# Altium project FMC_Version2.PrjPcb
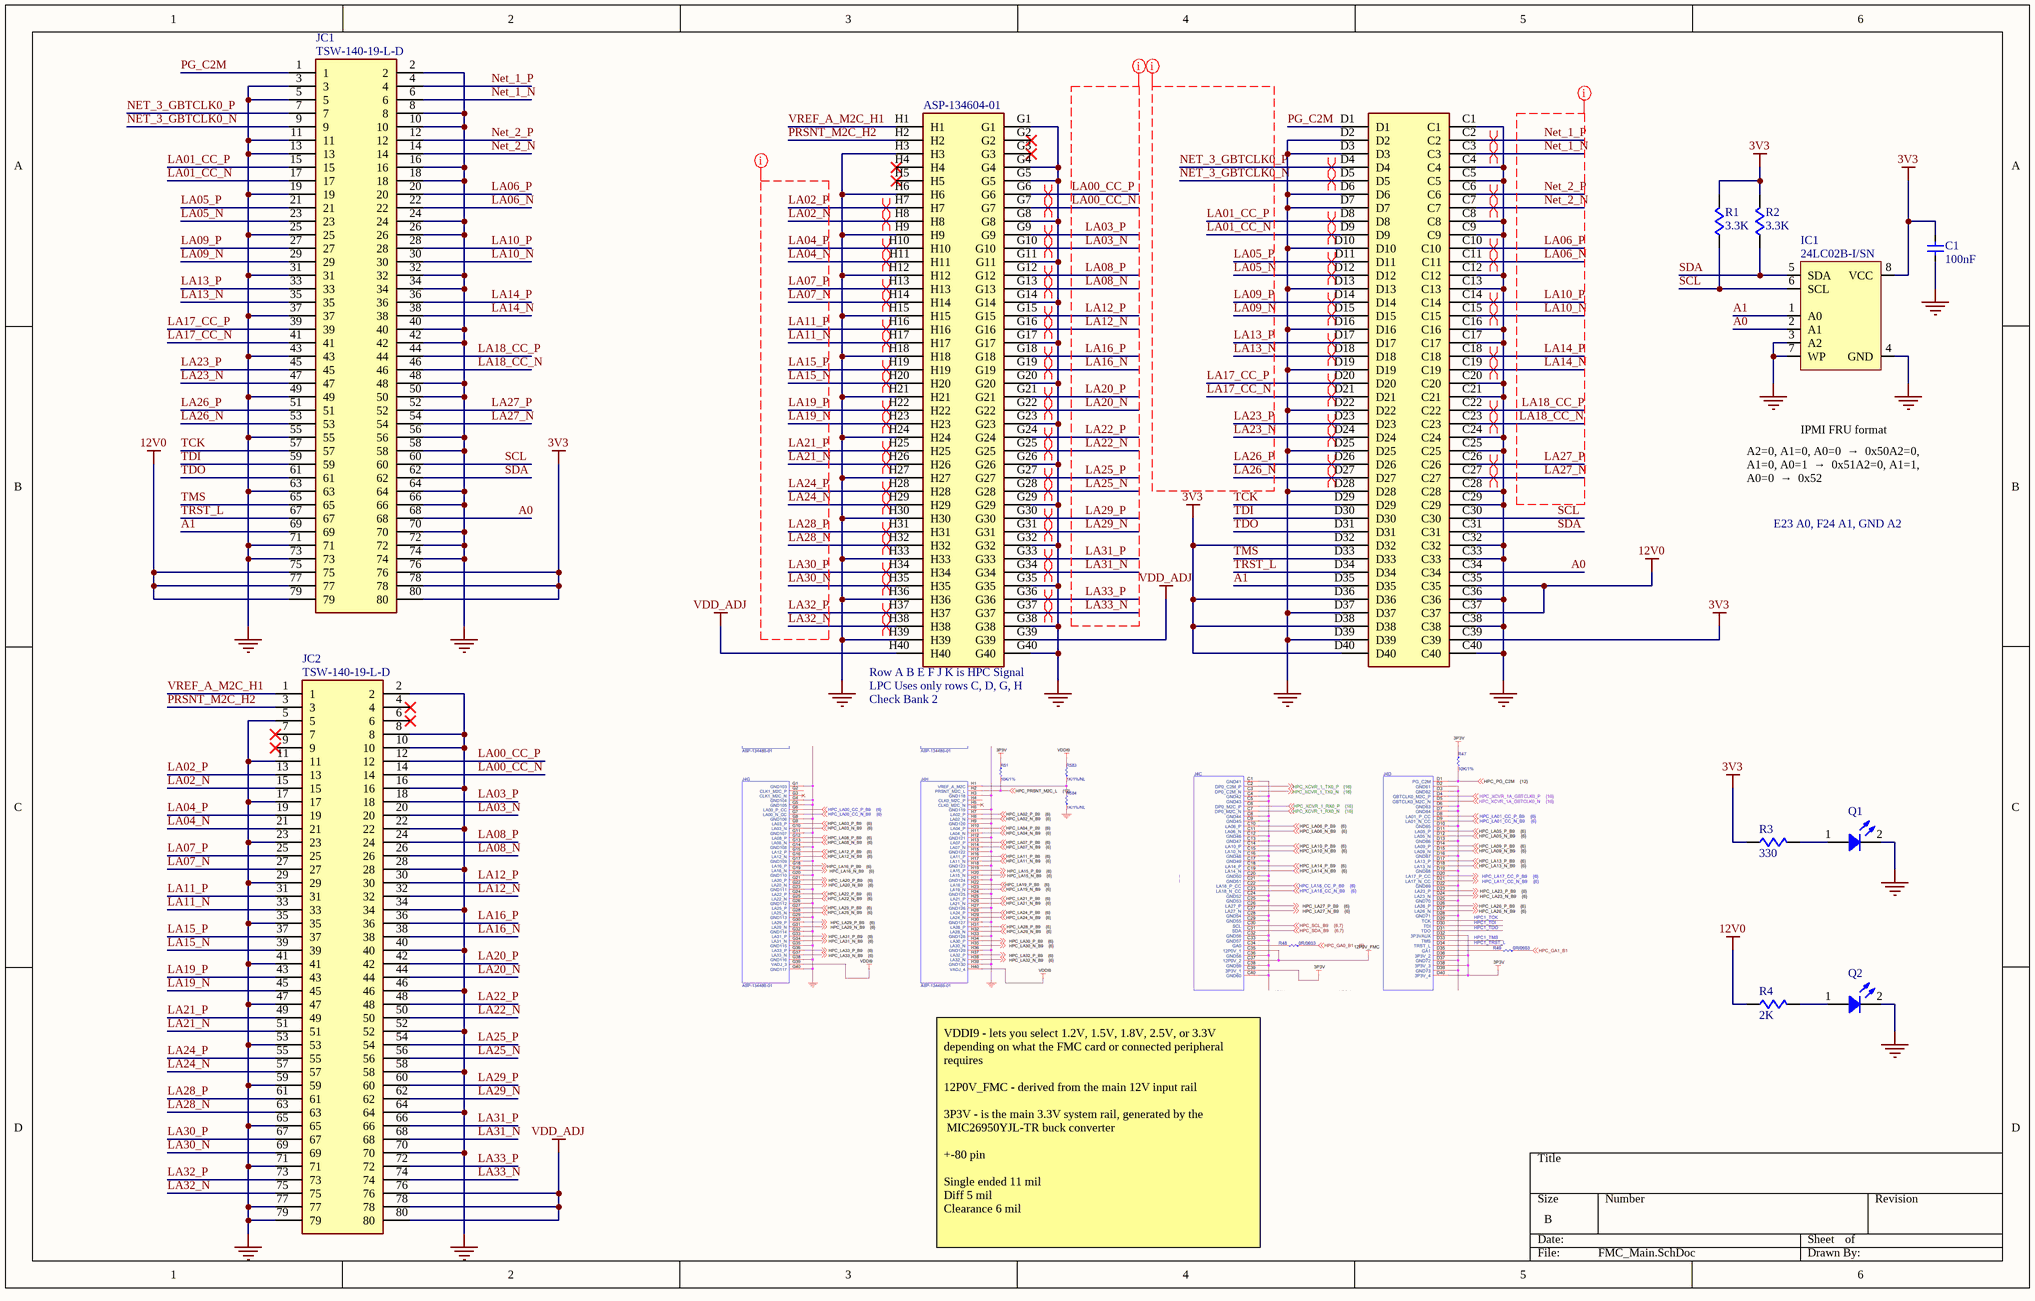
[diagram p0: FMC_Main.SchDoc]
1 sheet, 11 parts. Net scope: global (net labels, ports and power ports of the same name join across sheets).
Board file: FMC_Main.PcbDoc

## Sheet FMC_Main.SchDoc
size B; SheetNumber: 1; SheetTotal: 1

### Parts
C1  value 100nF  [CAP0402_N]  (hidden comment: CAPCER)
IC1  Manufacturer P/N 1: 24LC02B-I/SN  [SOIC_8]  (hidden comment: 24LC02B-ISN)
JC1  TSW-140-19-L-D  [TSW-140-19-L-D]
JC2  TSW-140-19-L-D  [TSW-140-19-L-D]
JC3  ASP-134604-01  [ASP-134604-01]
Q1  LED  [0603LED]  (value not drawn)
Q2  LED  [0603LED]  (value not drawn)
R1  value 3.3K  [RES0402_N]  (hidden comment: RES)
R2  value 3.3K  [RES0402_N]  (hidden comment: RES)
R3  value 330  [RES0402_N]  (hidden comment: RES)
R4  value 2K  [RES0402_N]  (hidden comment: RES)

### Nets
3V3: C1.2 IC1.8(VCC) JC1.76 JC1.78 JC1.80 JC3.C39 JC3.D32 JC3.D36 JC3.D38 JC3.D40 R1.2 R2.2 R3.1
12V0: JC1.75 JC1.77 JC1.79 JC3.C35 JC3.C37 R4.1
GND: C1.1 IC1.3(A2) IC1.4(GND) IC1.7(WP) JC1.2 JC1.3 JC1.5 JC1.8 JC1.10 JC1.11 JC1.13 JC1.16 JC1.18 JC1.19 JC1.24 JC1.25 JC1.26 JC1.31 JC1.32 JC1.34 JC1.37 JC1.40 JC1.42 JC1.43 JC1.48 JC1.49 JC1.50 JC1.55 JC1.56 JC1.58 JC1.63 JC1.64 JC1.66 JC1.70 JC1.71 JC1.72 JC1.73 JC1.74 JC2.2 JC2.5 JC2.8 JC2.10 JC2.11 JC2.16 JC2.17 JC2.22 JC2.23 JC2.28 JC2.29 JC2.34 JC2.35 JC2.40 JC2.41 JC2.46 JC2.47 JC2.52 JC2.53 JC2.58 JC2.59 JC2.64 JC2.65 JC2.70 JC2.71 JC2.77 JC2.79 JC3.C1 JC3.C4 JC3.C5 JC3.C8 JC3.C9 JC3.C12 JC3.C13 JC3.C16 JC3.C17 JC3.C20 JC3.C21 JC3.C24 JC3.C25 JC3.C28 JC3.C29 JC3.C32 JC3.C33 JC3.C36 JC3.C38 JC3.C40 JC3.D2 JC3.D3 JC3.D6 JC3.D7 JC3.D10 JC3.D13 JC3.D16 JC3.D19 JC3.D22 JC3.D25 JC3.D28 JC3.D37 JC3.D39 JC3.G1 JC3.G4 JC3.G5 JC3.G8 JC3.G11 JC3.G14 JC3.G17 JC3.G20 JC3.G23 JC3.G26 JC3.G29 JC3.G32 JC3.G35 JC3.G38 JC3.G40 JC3.H3 JC3.H6 JC3.H9 JC3.H12 JC3.H15 JC3.H18 JC3.H21 JC3.H24 JC3.H27 JC3.H30 JC3.H33 JC3.H36 JC3.H39 Q1.2 Q2.2
VDD_ADJ: JC2.76 JC2.78 JC2.80 JC3.G39 JC3.H40
A0: IC1.2(A1) JC1.68 JC3.C34
A1: IC1.1(A0) JC1.69 JC3.D35
LA00_CC_N: JC2.14 JC3.G7
LA00_CC_P: JC2.12 JC3.G6
LA01_CC_N: JC1.17 JC3.D9
LA01_CC_P: JC1.15 JC3.D8
LA02_N: JC2.15 JC3.H8
LA02_P: JC2.13 JC3.H7
LA03_N: JC2.20 JC3.G10
LA03_P: JC2.18 JC3.G9
LA04_N: JC2.21 JC3.H11
LA04_P: JC2.19 JC3.H10
LA05_N: JC1.23 JC3.D12
LA05_P: JC1.21 JC3.D11
LA06_N: JC1.22 JC3.C11
LA06_P: JC1.20 JC3.C10
LA07_N: JC2.27 JC3.H14
LA07_P: JC2.25 JC3.H13
LA08_N: JC2.26 JC3.G13
LA08_P: JC2.24 JC3.G12
LA09_N: JC1.29 JC3.D15
LA09_P: JC1.27 JC3.D14
LA10_N: JC1.30 JC3.C15
LA10_P: JC1.28 JC3.C14
LA11_N: JC2.33 JC3.H17
LA11_P: JC2.31 JC3.H16
LA12_N: JC2.32 JC3.G16
LA12_P: JC2.30 JC3.G15
LA13_N: JC1.35 JC3.D18
LA13_P: JC1.33 JC3.D17
LA14_N: JC1.38 JC3.C19
LA14_P: JC1.36 JC3.C18
LA15_N: JC2.39 JC3.H20
LA15_P: JC2.37 JC3.H19
LA16_N: JC2.38 JC3.G19
LA16_P: JC2.36 JC3.G18
LA17_CC_N: JC1.41 JC3.D21
LA17_CC_P: JC1.39 JC3.D20
LA18_CC_N: JC1.46 JC3.C23
LA18_CC_P: JC1.44 JC3.C22
LA19_N: JC2.45 JC3.H23
LA19_P: JC2.43 JC3.H22
LA20_N: JC2.44 JC3.G22
LA20_P: JC2.42 JC3.G21
LA21_N: JC2.51 JC3.H26
LA21_P: JC2.49 JC3.H25
LA22_N: JC2.50 JC3.G25
LA22_P: JC2.48 JC3.G24
LA23_N: JC1.47 JC3.D24
LA23_P: JC1.45 JC3.D23
LA24_N: JC2.57 JC3.H29
LA24_P: JC2.55 JC3.H28
LA25_N: JC2.56 JC3.G28
LA25_P: JC2.54 JC3.G27
LA26_N: JC1.53 JC3.D27
LA26_P: JC1.51 JC3.D26
LA27_N: JC1.54 JC3.C27
LA27_P: JC1.52 JC3.C26
LA28_N: JC2.63 JC3.H32
LA28_P: JC2.61 JC3.H31
LA29_N: JC2.62 JC3.G31
LA29_P: JC2.60 JC3.G30
LA30_N: JC2.69 JC3.H35
LA30_P: JC2.67 JC3.H34
LA31_N: JC2.68 JC3.G34
LA31_P: JC2.66 JC3.G33
LA32_N: JC2.75 JC3.H38
LA32_P: JC2.73 JC3.H37
LA33_N: JC2.74 JC3.G37
LA33_P: JC2.72 JC3.G36
Net_1_N: JC1.6 JC3.C3
Net_1_P: JC1.4 JC3.C2
Net_2_N: JC1.14 JC3.C7
Net_2_P: JC1.12 JC3.C6
NET_3_GBTCLK0_N: JC1.9 JC3.D5
NET_3_GBTCLK0_P: JC1.7 JC3.D4
PG_C2M: JC1.1 JC3.D1
PRSNT_M2C_H2: JC2.3 JC3.H2
SCL: IC1.6(SCL) JC1.60 JC3.C30 R1.1
SDA: IC1.5(SDA) JC1.62 JC3.C31 R2.1
TCK: JC1.57 JC3.D29
TDI: JC1.59 JC3.D30
TDO: JC1.61 JC3.D31
TMS: JC1.65 JC3.D33
TRST_L: JC1.67 JC3.D34
VREF_A_M2C_H1: JC2.1 JC3.H1
NetQ1_1: Q1.1 R3.2
NetQ2_1: Q2.1 R4.2

Not connected (* = marked no-connect by the designer): JC2 4* 6* 7* 9*; JC3 G2* G3* H4* H5*

### Layout directives
differential pair: LA00_CC_N, LA00_CC_P, LA01_CC_N, LA01_CC_P, LA02_N, LA02_P, LA03_N, LA03_P, LA04_N, LA04_P, LA05_N, LA05_P, LA06_N, LA06_P, LA07_N, LA07_P, LA08_N, LA08_P, LA09_N, LA09_P, LA10_N, LA10_P, LA11_N, LA11_P, LA12_N, LA12_P, LA13_N, LA13_P, LA14_N, LA14_P, LA15_N, LA15_P, LA16_N, LA16_P, LA17_CC_N, LA17_CC_P, LA18_CC_N, LA18_CC_P, LA19_N, LA19_P, LA20_N, LA20_P, LA21_N, LA21_P, LA22_N, LA22_P, LA23_N, LA23_P, LA24_N, LA24_P, LA25_N, LA25_P, LA26_N, LA26_P, LA27_N, LA27_P, LA28_N, LA28_P, LA29_N, LA29_P, LA30_N, LA30_P, LA31_N, LA31_P, LA32_N, LA32_P, LA33_N, LA33_P, Net_1_N, Net_1_P, Net_2_N, Net_2_P, NET_3_GBTCLK0_N, NET_3_GBTCLK0_P
rule Width Constraint [Pref Width = 4.5mil    Min Width = 4.5mil    Max Width = 4.5mil]; net class DIFF_PAIR: LA00_CC_N, LA00_CC_P, LA01_CC_N, LA01_CC_P, LA02_N, LA02_P, LA03_N, LA03_P, LA04_N, LA04_P, LA05_N, LA05_P, LA06_N, LA06_P, LA07_N, LA07_P, LA08_N, LA08_P, LA09_N, LA09_P, LA10_N, LA10_P, LA11_N, LA11_P, LA12_N, LA12_P, LA13_N, LA13_P, LA14_N, LA14_P, LA15_N, LA15_P, LA16_N, LA16_P, LA17_CC_N, LA17_CC_P, LA18_CC_N, LA18_CC_P, LA19_N, LA19_P, LA20_N, LA20_P, LA21_N, LA21_P, LA22_N, LA22_P, LA23_N, LA23_P, LA24_N, LA24_P, LA25_N, LA25_P, LA26_N, LA26_P, LA27_N, LA27_P, LA28_N, LA28_P, LA29_N, LA29_P, LA30_N, LA30_P, LA31_N, LA31_P, LA32_N, LA32_P, LA33_N, LA33_P, Net_1_N, Net_1_P, Net_2_N, Net_2_P, NET_3_GBTCLK0_N, NET_3_GBTCLK0_P

### Notes on the sheet
- IPMI FRU format
- A2=0, A1=0, A0=0  →  0x50A2=0, A1=0, A0=1  →  0x51A2=0, A1=1, A0=0  →  0x52
- E23 A0, F24 A1, GND A2
- (near JC3) Row A B E F J K is HPC Signal
- (near JC3) LPC Uses only rows C, D, G, H
- (near JC3) Check Bank 2
- VDDI9 - lets you select 1.2V, 1.5V, 1.8V, 2.5V, or 3.3V depending on what the FMC card or connected peripheral requires
  12P0V_FMC - derived from the main 12V input rail
  3P3V - is the main 3.3V system rail, generated by the
  MIC26950YJL-TR buck converter
  +-80 pin
  Single ended 11 mil
  Diff 5 mil
  Clearance 6 mil

### Library data of the parts
C1 = CC-000021: CAP CER 100nF 16V ±5% X7R 0402; Manufacturer Name 1: Yageo; Manufacturer P/N 1: CC0402JRX7R7BB104; Company P/N: CC-000021; Footprint: 0402; Tolerance: ±5%; Price @ 1k: 0.004; Manufacturer Name 2: AVX; Manufacturer P/N 2: 0402YC104JAT2A; Operating Temperature: -55°C ~ 125°C; Status: ACTIVE; Temperature Coefficient: X7R; Voltage: 16V
IC1 = IC-000083: IC EEPROM 2KBIT I2C 400KHZ 8MSOP; Manufacturer Name 1: Microchip Technology; Operating Voltage: 2.5V ~ 5.5V; Company P/N: IC-000083; Footprint: 8-MSOP; Features: EEPROM Memory IC 2Kbit I2C 400 kHz 900; Pin Count: 8; Price @ 1k: 0.35; Operating Temperature: -40°C ~ 85°C (TA)
JC1 JC2 = JC-000050: CONN HEADER TH 80POS 2.54MM; Manufacturer Name 1: MOLEX; Company P/N: JC-000050; Manufacturer P/N 1: TSW-140-19-L-D; Footprint: TH; Pin Count: 80; Price @ 1k: 4
JC3 = JC-000046: CONN ARRAY PLUG 160POS SMD GOLD; Manufacturer Name 1: Samtec Inc.; Company P/N: JC-000046; Manufacturer P/N 1: ASP-134604-01; Footprint: SMD; Pin Count: 160; Price @ 1k: 14
Q1 Q2 = QC-000018: LED YELLOW SMD 0603; Manufacturer P/N 1: LTST-C190KSKT; Manufacturer Name 1: Lite-On Inc.; Current: 20mA; Voltage: 3V; Company P/N: QC-000018; Footprint: 0603; Pin Count: 2; Price @ 1k: 0.046; Operating Temperature: -30°C ~ 85°C
R1 R2 = RC-000035: RES SMD 3.3K 1% 1/16W 0402; Manufacturer Name 1: Stackpole Electronics Inc; Manufacturer P/N 1: RMCF0402FT3K30; Company P/N: RC-000035; Footprint: 0402; Power: 1/16W; Tolerance: 1%; Price @ 1k: 0.002; Manufacturer Name 2: Yageo; Manufacturer P/N 2: AF0402FR-073K3L; Operating Temperature: -55°C ~ 155°C; Status: ACTIVE
R3 = RC-000069: RES 330 OHM 1% 1/10W 0402; Manufacturer Name 1: KOA Speer Electronics, Inc.; Manufacturer P/N 1: RK73H1ETTP3300F; Company P/N: RC-000069; Footprint: 0402; Power: 1/10W; Tolerance: 1%; Price @ 1k: 0.01; Operating Temperature: -55°C ~ 155°C
R4 = RC-000029: RES SMD 2K 1% 1/16W 0402; Manufacturer Name 1: Stackpole Electronics Inc; Manufacturer P/N 1: RMCF0402FT2K00; Company P/N: RC-000029; Footprint: 0402; Power: 1/16W; Tolerance: 1%; Price @ 1k: 0.002; Manufacturer Name 2: Yageo; Manufacturer P/N 2: RC0402FR-072KL; Operating Temperature: -55°C ~ 155°C; Status: ACTIVE